# Altium schematic sheet Sensors.SchDoc
size A3; SheetNumber: 5; SheetTotal: 5
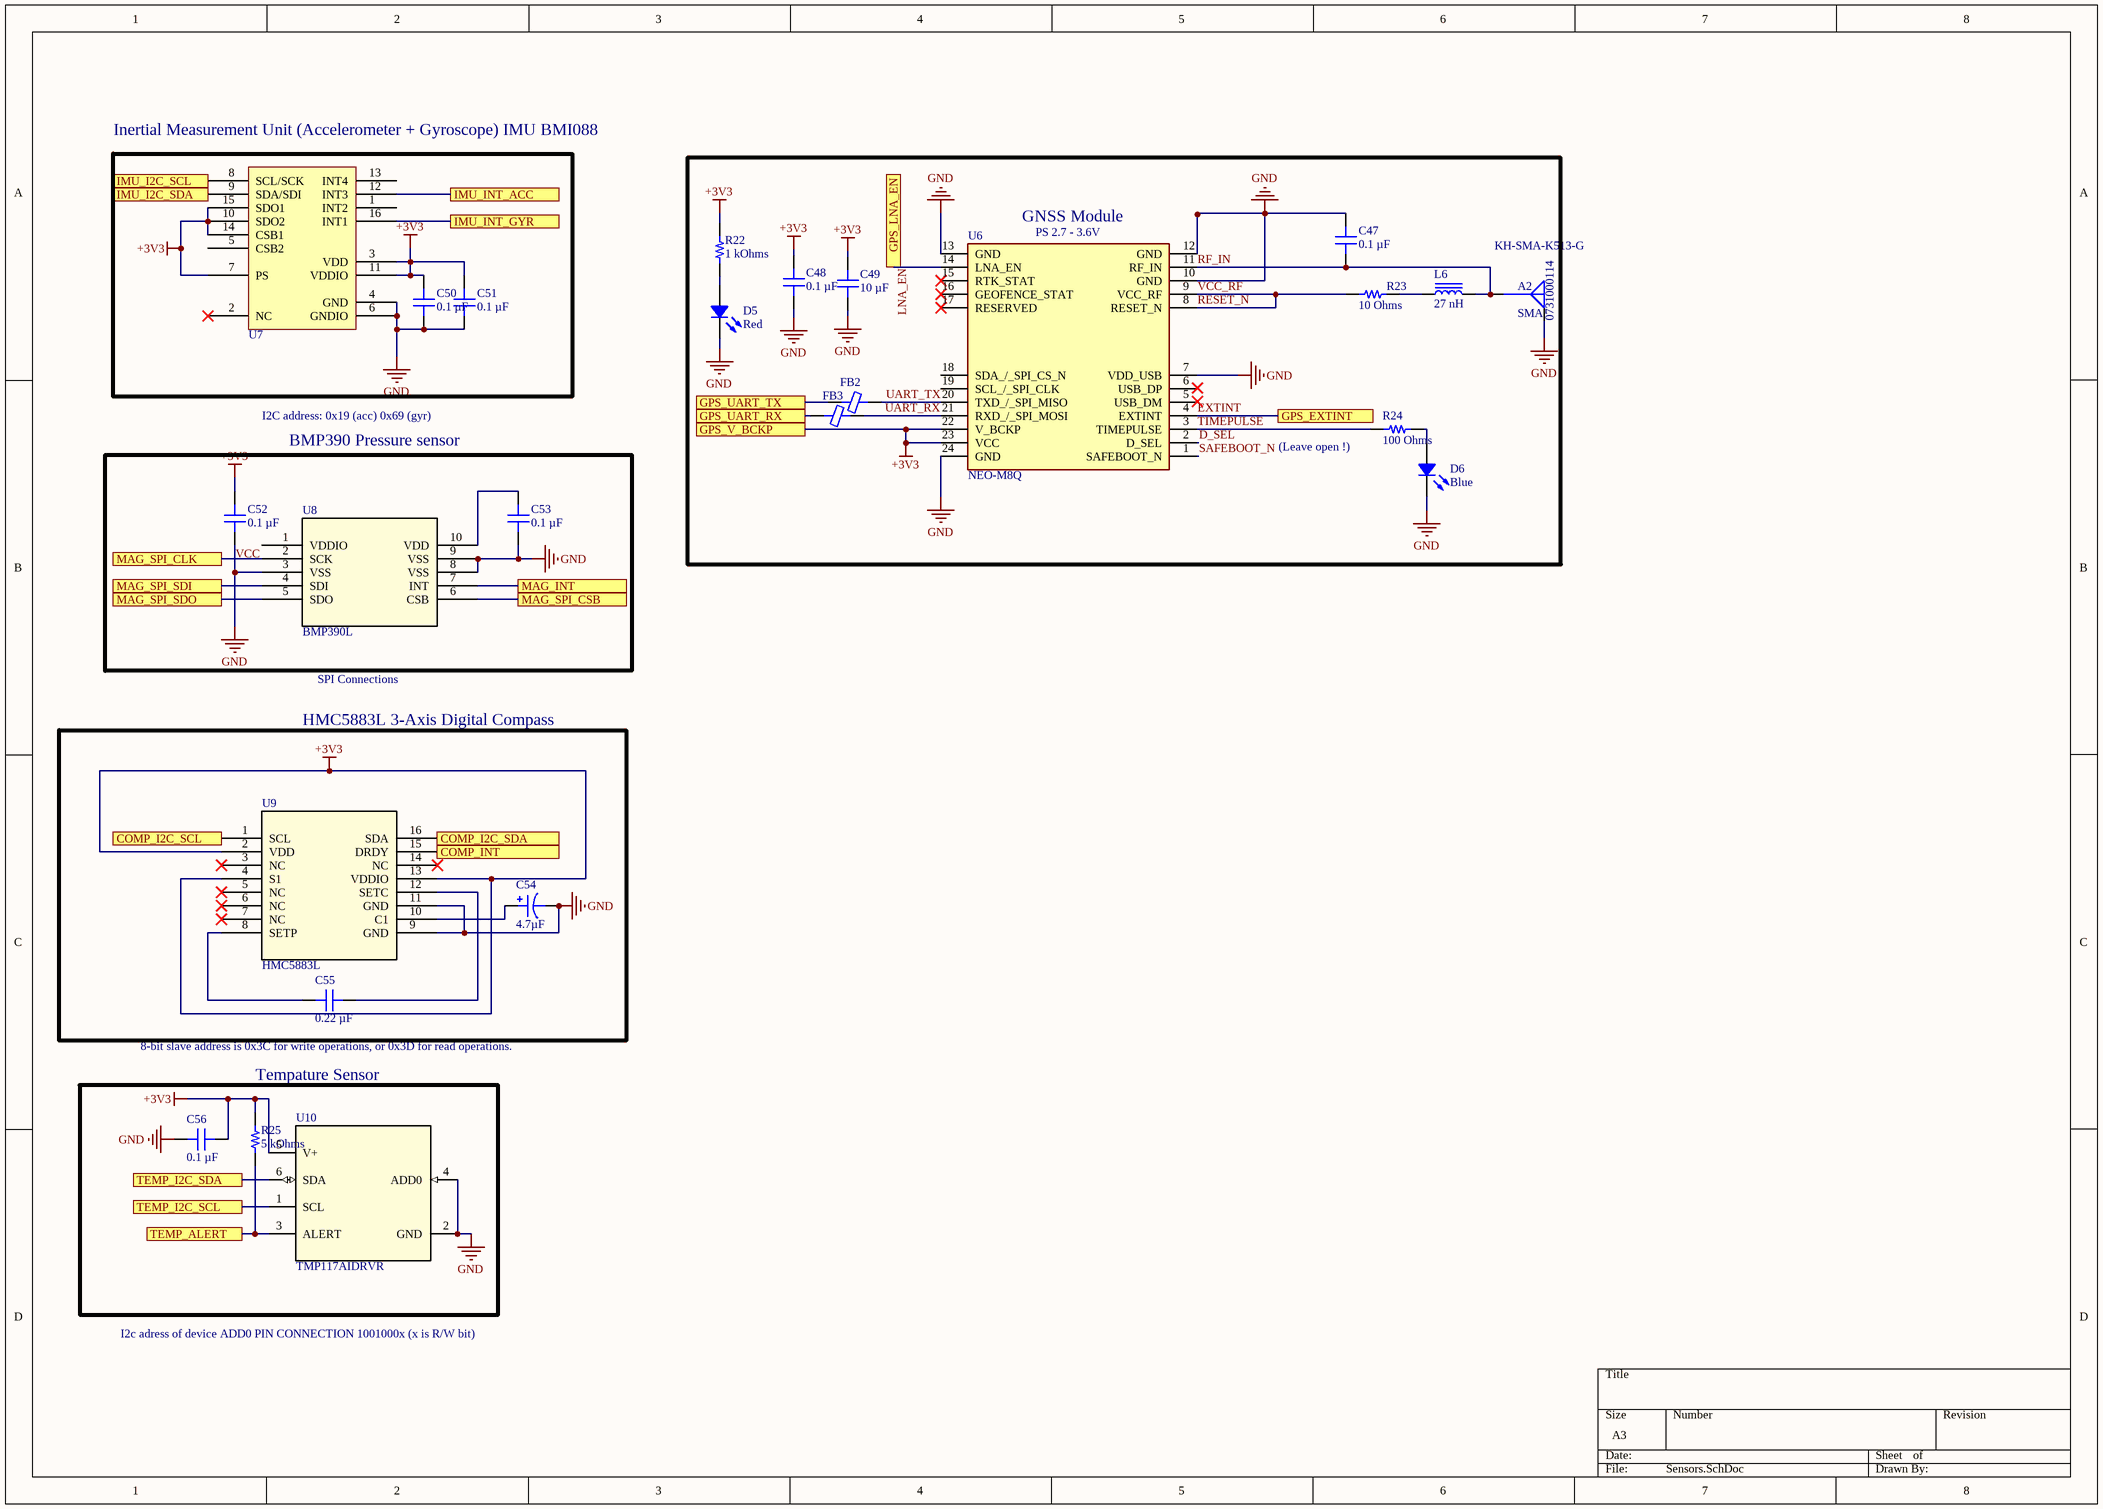
[diagram p0: Sensors.SchDoc]

## Parts
A2  0731000114  Connector Style: SMA  [MOLEX SD-73100-0114]
C47  0.1 µF  [CAP 0402_1005]
C48  0.1 µF  [CAP 0603_1608]
C49  10 µF  [CAP 1210_3225 - 1MM]
C50  value 0.1 µF  [CAP 1206_3216 - 1.8MM]  (hidden comment: 22µF)
C51  0.1 µF  [CAP 0603_1608]
C52  value 0.1 µF  [CAP 0603_1608]  (hidden comment: 220 pF)
C53  value 0.1 µF  [CAP 0603_1608]  (hidden comment: 1 µF)
C54  4.7µF  [CAP POL 1206_3216]
C55  value 0.22 µF  [CAP 0603_1608]  (hidden comment: 10000 pF)
C56  0.1 µF  [CAP 0603_1608]
D5  Red  [LED 0805_2012 RED]
D6  Blue  [LED 0603_1608 BLUE]
FB2  1 kOhms @ 100 MHz  [FER 0402_1005]  (value not drawn)
FB3  1 kOhms @ 100 MHz  [FER 0402_1005]  (value not drawn)
L6  27 nH  [IND 0402_1005]
R22  1 kOhms  [RES 0603_1608]
R23  10 Ohms  [RES 0402_1005]
R24  100 Ohms  [RES 0603_1608]
R25  5 kOhms  [RES 0603_1608]
U6  NEO-M8Q  [NEO-M8U]
U7  BMI088_2  [QFN_BMI085_BOS]  (value not drawn)
U8  BMP390L  [BMP390L_BOS]
U9  HMC5883L  [LPCC16_HNW]
U10  TMP117AIDRVR  [DRV0006B]

## Blocks framed on the sheet
GNSS Module: A2 C47-C49 D5 D6 FB2 FB3 L6 R22-R24 U6
BMP390 Pressure sensor: C52 C53 U8
HMC5883L 3-Axis Digital Compass: C54 C55 U9
Tempature Sensor: C56 R25 U10

## Ports
COMP_I2C_SCL, COMP_I2C_SDA, COMP_INT, GPS_EXTINT, GPS_LNA_EN, GPS_UART_RX, GPS_UART_TX, GPS_V_BCKP, IMU_I2C_SCL, IMU_I2C_SDA, IMU_INT_ACC, IMU_INT_GYR, MAG_INT, MAG_SPI_CLK, MAG_SPI_CSB, MAG_SPI_SDI, MAG_SPI_SDO, TEMP_ALERT, TEMP_I2C_SCL, TEMP_I2C_SDA

## Nets
+3V3: C48.2 C49.2 C50.2 C51.2 C52.2 C56.1 R22.2 R25.2 U6.22(V_BCKP) U6.23(VCC) U7.3(VDD) U7.7(PS) U7.10(SDO2) U7.11(VDDIO) U7.14(CSB1) U7.15(SDO1) U9.2(VDD) U9.4(S1) U9.13(VDDIO) U10.5(V+) ; port GPS_V_BCKP
GND: A2.G C47.2 C48.1 C49.1 C50.1 C51.1 C52.1 C53.1 C54.2 C56.2 D5.2 D6.2 U6.7(VDD_USB) U6.10(GND) U6.12(GND) U6.13(GND) U6.24(GND) U7.4(GND) U7.6(GNDIO) U8.3(VSS) U8.8(VSS) U8.9(VSS) U9.9(GND) U9.11(GND) U10.2(GND) U10.4(ADD0)
COMP_I2C_SCL: U9.1(SCL) ; port COMP_I2C_SCL
COMP_I2C_SDA: U9.16(SDA) ; port COMP_I2C_SDA
COMP_INT: U9.15(DRDY) ; port COMP_INT
D_SEL: U6.2(D_SEL)
EXTINT: U6.4(EXTINT) ; port GPS_EXTINT
GPS_UART_RX: FB3.1 ; port GPS_UART_RX
GPS_UART_TX: FB2.1 ; port GPS_UART_TX
IMU_I2C_SCL: U7.8(SCL/SCK) ; port IMU_I2C_SCL
IMU_I2C_SDA: U7.9(SDA/SDI) ; port IMU_I2C_SDA
IMU_INT_ACC: U7.12(INT3) ; port IMU_INT_ACC
IMU_INT_GYR: U7.16(INT1) ; port IMU_INT_GYR
LNA_EN: U6.14(LNA_EN) ; port GPS_LNA_EN
MAG_INT: U8.7(INT) ; port MAG_INT
MAG_SPI_CLK: U8.2(SCK) ; port MAG_SPI_CLK
MAG_SPI_CSB: U8.6(CSB) ; port MAG_SPI_CSB
MAG_SPI_SDI: U8.4(SDI) ; port MAG_SPI_SDI
MAG_SPI_SDO: U8.5(SDO) ; port MAG_SPI_SDO
RESET_N: R23.1 U6.8(RESET_N) U6.9(VCC_RF)  [also labelled VCC_RF]
RF_IN: A2.S C47.1 L6.2 U6.11(RF_IN)
SAFEBOOT_N: U6.1(SAFEBOOT_N)
TEMP_ALERT: R25.1 U10.3(ALERT) ; port TEMP_ALERT
TEMP_I2C_SCL: U10.1(SCL) ; port TEMP_I2C_SCL
TEMP_I2C_SDA: U10.6(SDA) ; port TEMP_I2C_SDA
TIMEPULSE: R24.2 U6.3(TIMEPULSE)
UART_RX: FB3.2 U6.21(RXD_/_SPI_MOSI)
UART_TX: FB2.2 U6.20(TXD_/_SPI_MISO)
VCC: U8.1(VDDIO)
NetC53_2: C53.2 U8.10(VDD)
NetC54_1: C54.1 U9.10(C1)
NetC55_1: C55.1 U9.8(SETP)
NetC55_2: C55.2 U9.12(SETC)
NetD5_1: D5.1 R22.1
NetD6_1: D6.1 R24.1
NetL6_1: L6.1 R23.2

Not connected (* = marked no-connect by the designer): U6 5(USB_DM) 6(USB_DP) 15(RTK_STAT)* 16(GEOFENCE_STAT)* 17(RESERVED)* 18(SDA_/_SPI_CS_N) 19(SCL_/_SPI_CLK); U7 1(INT2) 2(NC)* 5(CSB2) 13(INT4); U9 3(NC)* 5(NC)* 6(NC)* 7(NC)* 14(NC)*

## Notes on the sheet
- (near U7) Inertial Measurement Unit (Accelerometer + Gyroscope) IMU BMI088
- (near U6) PS 2.7 - 3.6V
- KH-SMA-K513-G
- I2C address: 0x19 (acc) 0x69 (gyr)
- (near R24) (Leave open !)
- SPI Connections
- (near C55) 8-bit slave address is 0x3C for write operations, or 0x3D for read operations.
- I2c adress of device ADD0 PIN CONNECTION 1001000x (x is R/W bit)

## Library data of the parts
A2 = 0731000114: CONN SMA RCPT R/A 50 OHM PCB; Manufacturer: Molex; Connector Type: Receptacle, Female Socket; Contact Termination: Solder; Frequency - Max: 18 GHz; Impedance: 50Ohm; Number of Ports: 1; Part Number: 0731000114; ComponentLink1Description: Datasheet; ComponentLink1URL: https://www.molex.com/pdm_docs/sd/731000114_sd.pdf; ComponentLink2Description: DigiKey Link; ComponentLink2URL: https://www.digikey.com/en/products/detail/molex/0731000114/1465147; Fastening Type: Threaded; Housing Color: Gold; LastUpdated: 29.06.2022 18:00:24; Lifecycle Status: Active; Minimum Order: 1; Mounting Type: Through Hole, Right Angle; Packaging: Tray; Part Status: Active; Price: 3.19; Series: 73100; Shield Termination: Solder; Supplier 1: DigiKey; Supplier Part Number 1: WM5525-ND
C47 = CL05B104KO5NNNC: CAP CER 0.1UF 16V X7R 0402; manufacturer: Samsung Electro-Mechanics; Tolerance: ±10%; Part Number: CL05B104KO5NNNC; Value: 0.1 µF; Applications: General Purpose; Capacitance: 0.1 µF; componentlink1description: Datasheet; componentlink1url: http://www.samsungsem.com/kr/support/product-search/mlcc/CL05B104KO5NNNC.jsp; componentlink2description: DigiKey Link; componentlink2url: https://www.digikey.com/en/products/detail/samsung-electro-mechanics/CL05B104KO5NNNC/3886659; Device Package: 0402 (1005 Metric); lastupdated: 3.03.2023 20:04:29; Lifecycle Status: Active; Minimum Order: 1; Mounting Type: Surface Mount, MLCC; Operating Temperature: -55°C ~ 125°C; Package / Case: 0402 (1005 Metric); packaging: CutTape; partid: 6066; Part Status: Active; price: 0.01; series: CL; Size / Dimension: 0.039" L x 0.020" W (1.00mm x 0.50mm); Supplier 1: DigiKey; Supplier Part Number 1: 1276-1001-1-ND; Temperature Coefficient: X7R; Thickness (Max): 0.022" (0.55mm); Voltage - Rated: 16V
C48 = CC0603KRX7R6BB104: CAP CER 0.1UF 10V X7R 0603; manufacturer: Yageo; Tolerance: ±10%; Part Number: CC0603KRX7R6BB104; Value: 0.1 µF; Applications: General Purpose; Capacitance: 0.1 µF; componentlink1description: Datasheet; componentlink1url: https://www.yageo.com/upload/media/product/productsearch/datasheet/mlcc/UPY-GPHC_X7R_6.3V-to-50V_18.pdf; componentlink2description: DigiKey Link; componentlink2url: https://www.digikey.com/en/products/detail/yageo/CC0603KRX7R6BB104/5883741; Device Package: 0603 (1608 Metric); lastupdated: 7.03.2023 20:08:13; Lifecycle Status: Active; Minimum Order: 1; Mounting Type: Surface Mount, MLCC; Operating Temperature: -55°C ~ 125°C; Package / Case: 0603 (1608 Metric); packaging: TapeAndReel; partid: 7937; Part Status: Active; price: 0.01; series: CC; Size / Dimension: 0.063" L x 0.031" W (1.60mm x 0.80mm); Supplier 1: DigiKey; Supplier Part Number 1: 311-4055-1-ND; Temperature Coefficient: X7R; Thickness (Max): 0.035" (0.90mm); Voltage - Rated: 10V
C49 = EMK325BJ106KN-T: CAP CER 10UF 16V X5R 1210; manufacturer: Taiyo Yuden; Tolerance: ±10%; Part Number: EMK325BJ106KN-T; Value: 10 µF; Applications: SMPS Filtering; Capacitance: 10 µF; componentlink1description: Datasheet; componentlink1url: http://www.yuden.co.jp/productdata/catalog/mlcc06_e.pdf; componentlink2description: DigiKey Link; componentlink2url: https://www.digikey.com/en/products/detail/taiyo-yuden/EMK325BJ106KN-T/930729; Device Package: 1210 (3225 Metric); lastupdated: 7.03.2023 20:30:00; Lifecycle Status: Active; Minimum Order: 1; Mounting Type: Surface Mount, MLCC; Operating Temperature: -55°C ~ 85°C; Package / Case: 1210 (3225 Metric); packaging: TapeAndReel; partid: 47465; Part Status: Active; price: 0.07; series: M; Size / Dimension: 0.126" L x 0.098" W (3.20mm x 2.50mm); Supplier 1: DigiKey; Supplier Part Number 1: 587-1376-1-ND; Temperature Coefficient: X5R; Thickness (Max): 0.083" (2.10mm); Voltage - Rated: 16V
C50-C53 = CL10B104KO8NNNC: CAP CER 0.1UF 16V X7R 0603; manufacturer: Samsung Electro-Mechanics; Tolerance: ±10%; Part Number: CL10B104KO8NNNC; Applications: General Purpose; Capacitance: 0.1 µF; componentlink1description: Datasheet; componentlink1url: http://www.samsungsem.com/kr/support/product-search/mlcc/CL10B104KO8NNNC.jsp; componentlink2description: DigiKey Link; componentlink2url: https://www.digikey.com/en/products/detail/samsung-electro-mechanics/CL10B104KO8NNNC/3886663; Device Package: 0603 (1608 Metric); lastupdated: 28.02.2023 20:08:16; Lifecycle Status: Active; Minimum Order: 1; Mounting Type: Surface Mount, MLCC; Operating Temperature: -55°C ~ 125°C; Package / Case: 0603 (1608 Metric); packaging: TapeAndReel; partid: 9791; Part Status: Active; price: 0.01; series: CL; Size / Dimension: 0.063" L x 0.031" W (1.60mm x 0.80mm); Supplier 1: DigiKey; Supplier Part Number 1: 1276-1005-1-ND; Temperature Coefficient: X7R; Thickness (Max): 0.035" (0.90mm); Voltage - Rated: 16V
  C51: Value: 0.1 µF
C54 = TAJA475K016RNJ: CAP TANT 4.7UF 10% 16V 1206; manufacturer: AVX Corporation; Manufacturer Size Code: A; ESR (Equivalent Series Resistance): 4Ohm; Type: Molded; Part Number: TAJA475K016RNJ; Value: 4.7µF; Capacitance: 4.7µF; componentlink1description: Datasheet; componentlink1url: http://datasheets.avx.com/TAJ.pdf; componentlink2description: DigiKey Link; componentlink2url: http://digikey.com/product-detail/en/avx-corporation/TAJA475K016RNJ/478-3868-1-ND/1126914; Device Package: 1206 (3216 Metric); Features: General Purpose; Height - Seated (Max): 0.071" (1.80mm); lastupdated: 2.09.2020 01:15:58; Lifecycle Status: Active; Minimum Order: 1; Mounting Type: Surface Mount; Operating Temperature: -55°C ~ 125°C; Package / Case: 1206 (3216 Metric); packaging: TapeAndReel; partid: 328; Part Status: Active; price: 0.09; series: TAJ; Size / Dimension: 0.126" L x 0.063" W (3.20mm x 1.60mm); Supplier 1: DigiKey; Supplier Part Number 1: 478-3868-1-ND; Tolerance: ±10%; Voltage - Rated: 16V
C55 = CL05A224KP5NNNC: CAP CER 0.22UF 10V X5R 0402; manufacturer: Samsung Electro-Mechanics; Tolerance: ±10%; Part Number: CL05A224KP5NNNC; Applications: General Purpose; Capacitance: 0.22 µF; componentlink1description: Datasheet; componentlink1url: http://www.samsungsem.com/kr/support/product-search/mlcc/CL05A224KP5NNNC.jsp; componentlink2description: DigiKey Link; componentlink2url: https://www.digikey.com/en/products/detail/samsung-electro-mechanics/CL05A224KP5NNNC/3886707; Device Package: 0402 (1005 Metric); lastupdated: 28.02.2023 20:04:39; Lifecycle Status: Active; Minimum Order: 1; Mounting Type: Surface Mount, MLCC; Operating Temperature: -55°C ~ 85°C; Package / Case: 0402 (1005 Metric); packaging: TapeAndReel; partid: 3132; Part Status: Active; price: 0.01; series: CL; Size / Dimension: 0.039" L x 0.020" W (1.00mm x 0.50mm); Supplier 1: DigiKey; Supplier Part Number 1: 1276-1049-1-ND; Temperature Coefficient: X5R; Thickness (Max): 0.022" (0.55mm); Voltage - Rated: 10V
C56 = CC0603KRX7R7BB104: CAP CER 0.1UF 16V X7R 0603; manufacturer: Yageo; Tolerance: ±10%; Part Number: CC0603KRX7R7BB104; Value: 0.1 µF; Applications: General Purpose; Capacitance: 0.1 µF; componentlink1description: Datasheet; componentlink1url: https://www.yageo.com/upload/media/product/productsearch/datasheet/mlcc/UPY-GPHC_X7R_6.3V-to-50V_18.pdf; componentlink2description: DigiKey Link; componentlink2url: https://www.digikey.com/en/products/detail/yageo/CC0603KRX7R7BB104/302822; Device Package: 0603 (1608 Metric); lastupdated: 4.08.2022 04:29:59; Lifecycle Status: Active; Minimum Order: 1; Mounting Type: Surface Mount, MLCC; Operating Temperature: -55°C ~ 125°C; Package / Case: 0603 (1608 Metric); packaging: TapeAndReel; partid: 16746; Part Status: Active; price: 0.01; series: CC; Size / Dimension: 0.063" L x 0.031" W (1.60mm x 0.80mm); Supplier 1: DigiKey; Supplier Part Number 1: 311-1088-1-ND; Temperature Coefficient: X7R; Thickness (Max): 0.035" (0.90mm); Voltage - Rated: 16V
D5 = LTST-C170KRKT: LED RED CLEAR SMD; Manufacturer: Lite-On Inc.; Configuration: Standard; Current - Test: 20mA; Lens Color: Colorless; Lens Size: 1.40mm x 1.25mm; Lens Style: Rectangle with Flat Top; Millicandela Rating: 54mcd; Viewing Angle: 130°; Voltage - Forward (Vf) (Typ): 2V; Wavelength - Dominant: 631nm; Wavelength - Peak: 639nm; Part Number: LTST-C170KRKT; Color: Red; ComponentLink1Description: Datasheet; ComponentLink1URL: http://optoelectronics.liteon.com/upload/download/DS-22-99-0150/LTST-C170KRKT.pdf; ComponentLink2Description: DigiKey Link; ComponentLink2URL: http://digikey.com/product-detail/en/lite-on-inc/LTST-C170KRKT/160-1415-1-ND/386778; Device Package: 0805 (2012 Metric); Height (Max): 1.10mm; LastUpdated: 7.03.2023 20:55:45; Lens Transparency: Clear; Lifecycle Status: Active; Minimum Order: 1; Mounting Type: Surface Mount; Package / Case: 0805 (2012 Metric); Packaging: TapeAndReel; PartId: 350; Part Status: Active; Price: 0.06; Series: -; Size / Dimension: 2.00mm L x 1.25mm W; Supplier 1: DigiKey; Supplier Part Number 1: 160-1415-1-ND; Value: Red
D6 = LTST-C190TBKT: LED BLUE CLEAR CHIP SMD; Manufacturer: Lite-On Inc.; Configuration: Standard; Current - Test: 20mA; Lens Color: Colorless; Lens Size: 1.10mm x 0.80mm; Lens Style: Rectangle with Flat Top; Millicandela Rating: 104mcd; Viewing Angle: 130°; Voltage - Forward (Vf) (Typ): 3.3V; Wavelength - Dominant: 470nm; Wavelength - Peak: 468nm; Part Number: LTST-C190TBKT; Color: Blue; ComponentLink1Description: Datasheet; ComponentLink1URL: http://optoelectronics.liteon.com/upload/download/DS-22-99-0224/LTST-C190TBKT.PDF; ComponentLink2Description: DigiKey Link; ComponentLink2URL: http://digikey.com/product-detail/en/lite-on-inc/LTST-C190TBKT/160-1646-1-ND/573586; Device Package: 0603 (1608 Metric); Height (Max): 0.90mm; LastUpdated: 5.03.2023 20:55:19; Lens Transparency: Clear; Lifecycle Status: Active; Minimum Order: 1; Mounting Type: Surface Mount; Package / Case: 0603 (1608 Metric); Packaging: TapeAndReel; PartId: 831; Part Status: Active; Price: 0.08; Series: -; Size / Dimension: 1.60mm L x 0.80mm W; Supplier 1: DigiKey; Supplier Part Number 1: 160-1646-1-ND; Supplier Device Package: Chip LED; Value: Blue
FB2 FB3 = BLM15AX102SN1D: FERRITE BEAD 1K OHM 0402 1LN; Manufacturer: Murata Electronics; Current Rating (Max): 350mA; DC Resistance (DCR) (Max): 490mOhm; Number of Lines: 1; Part Number: BLM15AX102SN1D; ComponentLink1Description: Datasheet; ComponentLink1URL: https://www.murata.com/en-us/products/productdata/8796740059166/ENFA0018.pdf; ComponentLink2Description: DigiKey Link; ComponentLink2URL: https://www.digikey.com/en/products/detail/murata-electronics/BLM15AX102SN1D/2256877; Device Package: 0402 (1005 Metric); Height (Max): 0.022" (0.55mm); Impedance @ Frequency: 1 kOhms @ 100 MHz; LastUpdated: 7.03.2023 20:49:02; Lifecycle Status: Active; Minimum Order: 1; Mounting Type: Surface Mount; Operating Temperature: -55°C ~ 125°C; Package / Case: 0402 (1005 Metric); Packaging: TapeAndReel; PartId: 398; Part Status: Active; Price: 0.01; Series: EMIFIL®, BLM15; Size / Dimension: 0.039" L x 0.022" W (1.00mm x 0.55mm); Supplier 1: DigiKey; Supplier Part Number 1: 490-5442-1-ND; Value: 1 kOhms @ 100 MHz
L6 = LQG15HS27NJ02D: FIXED IND 27NH 350MA 460MOHM SMD; Manufacturer: Murata Electronics; DC Resistance (DCR): 460mOhm Max; Frequency - Self Resonant: 1.7GHz; Inductance Frequency - Test: 100 MHz; Material - Core: Air; Q @ Freq: 8 @ 100MHz; Shielding: Unshielded; Tolerance: ±5%; Type: Multilayer; Part Number: LQG15HS27NJ02D; ComponentLink1Description: Datasheet; ComponentLink1URL: https://search.murata.co.jp/Ceramy/image/img/P02/JELF243B-0010.pdf; ComponentLink2Description: DigiKey Link; ComponentLink2URL: https://www.digikey.com/en/products/detail/murata-electronics/LQG15HS27NJ02D/662877; Current Rating (Amps): 350 mA; Device Package: 0402 (1005 Metric); Height - Seated (Max): 0.022" (0.55mm); Inductance: 27 nH; LastUpdated: 7.03.2023 21:02:57; Lifecycle Status: Active; Minimum Order: 1; Mounting Type: Surface Mount; Operating Temperature: -55°C ~ 125°C; Package / Case: 0402 (1005 Metric); Packaging: TapeAndReel; PartId: 1475; Part Status: Active; Price: 0.02; Series: LQG15; Size / Dimension: 0.039" L x 0.020" W (1.00mm x 0.50mm); Supplier 1: DigiKey; Supplier Part Number 1: 490-2628-1-ND; Supplier Device Package: 0402 (1005 Metric); Value: 27 nH
R22 = RC0603FR-071KL: RES SMD 1K OHM 1% 1/10W 0603; Manufacturer: Yageo; Power (Watts): 0.1W, 1/10W; Temperature Coefficient: ±100ppm/°C; Part Number: RC0603FR-071KL; Value: 1 kOhms; ComponentLink1Description: Datasheet; ComponentLink1URL: https://www.yageo.com/upload/media/product/productsearch/datasheet/rchip/PYu-RC_Group_51_RoHS_L_10.pdf; ComponentLink2Description: DigiKey Link; ComponentLink2URL: http://digikey.com/product-detail/en/yageo/RC0603FR-071KL/311-1.00KHRCT-ND/729790; Composition: Thick Film; Device Package: 0603 (1608 Metric); Features: Moisture Resistant; Height - Seated (Max): 0.022" (0.55mm); LastUpdated: 2.09.2020 01:09:45; Lifecycle Status: Active; Minimum Order: 1; Number of Terminations: 2; Operating Temperature: -55°C ~ 155°C; Package / Case: 0603 (1608 Metric); Packaging: CutTape; PartId: 22600; Part Status: Active; Price: 0.10; Resistance: 1 kOhms; Series: RC; Size / Dimension: 0.063" L x 0.031" W (1.60mm x 0.80mm); Supplier 1: DigiKey; Supplier Part Number 1: 311-1.00KHRCT-ND; Supplier Device Package: 0603; Tolerance: ±1%
R23 = ERA-2AKD100X: RES SMD 10 OHM 0.5% 1/16W 0402; Manufacturer: Panasonic Electronic Components; Power (Watts): 0.063W, 1/16W; Temperature Coefficient: ±100ppm/°C; Part Number: ERA-2AKD100X; Value: 10 Ohms; ComponentLink1Description: Datasheet; ComponentLink1URL: https://industrial.panasonic.com/cdbs/www-data/pdf/RDM0000/AOA0000C307.pdf; ComponentLink2Description: DigiKey Link; ComponentLink2URL: http://digikey.com/product-detail/en/panasonic-electronic-components/ERA-2AKD100X/P10DDCT-ND/1706232; Composition: Thin Film; Device Package: 0402 (1005 Metric); Features: Automotive AEC-Q200; Height - Seated (Max): 0.016" (0.40mm); LastUpdated: 2.09.2020 01:08:09; Lifecycle Status: Active; Minimum Order: 1; Number of Terminations: 2; Operating Temperature: -55°C ~ 155°C; Package / Case: 0402 (1005 Metric); Packaging: TapeAndReel; PartId: 3168; Part Status: Active; Price: 0.01; Ratings: AEC-Q200; Resistance: 10 Ohms; Series: ERA-2A; Size / Dimension: 0.039" L x 0.020" W (1.00mm x 0.50mm); Supplier 1: DigiKey; Supplier Part Number 1: P10DDCT-ND; Supplier Device Package: 0402; Tolerance: ±0.5%
R24 = RK73G1JTTD1000F: RES 100 OHM 1% 1/10W 0603; Manufacturer: KOA Speer Electronics, Inc.; Power (Watts): 0.1W, 1/10W; Temperature Coefficient: ±50ppm/°C; Part Number: RK73G1JTTD1000F; Value: 100 Ohms; ComponentLink1Description: Datasheet; ComponentLink1URL: https://www.koaspeer.com/pdfs/RK73G.pdf; ComponentLink2Description: DigiKey Link; ComponentLink2URL: https://www.digikey.com/en/products/detail/koa-speer-electronics-inc/RK73G1JTTD1000F/9854468; Composition: Thick Film; Device Package: 0603 (1608 Metric); Features: Automotive AEC-Q200; Height - Seated (Max): 0.022" (0.55mm); LastUpdated: 5.03.2023 20:27:16; Lifecycle Status: Active; Minimum Order: 1; Number of Terminations: 2; Operating Temperature: -55°C ~ 155°C; Package / Case: 0603 (1608 Metric); Packaging: TapeAndReel; PartId: 65534; Part Status: Active; Price: 0.03; Ratings: AEC-Q200; Resistance: 100 Ohms; Series: RK73G; Size / Dimension: 0.063" L x 0.031" W (1.60mm x 0.80mm); Supplier 1: DigiKey; Supplier Part Number 1: 2019-RK73G1JTTD1000FCT-ND; Supplier Device Package: 0603; Tolerance: ±1%
R25 = RT0603BRE075KL: RES 5K OHM 0.1% 1/10W 0603; Manufacturer: Yageo; Power (Watts): 0.1W, 1/10W; Temperature Coefficient: ±50ppm/°C; Part Number: RT0603BRE075KL; Value: 5 kOhms; ComponentLink1Description: Datasheet; ComponentLink1URL: https://www.yageo.com/upload/media/product/productsearch/datasheet/rchip/PYu-RT_1-to-0.01_RoHS_L_12.pdf; ComponentLink2Description: DigiKey Link; ComponentLink2URL: https://www.digikey.com/en/products/detail/yageo/RT0603BRE075KL/7708365; Composition: Thin Film; Device Package: 0603 (1608 Metric); Height - Seated (Max): 0.022" (0.55mm); LastUpdated: 21.08.2022 20:20:42; Lifecycle Status: Active; Minimum Order: 1; Number of Terminations: 2; Operating Temperature: -55°C ~ 155°C; Package / Case: 0603 (1608 Metric); Packaging: TapeAndReel; PartId: 67915; Part Status: Active; Price: 0.05; Resistance: 5 kOhms; Series: RT; Size / Dimension: 0.063" L x 0.031" W (1.60mm x 0.80mm); Supplier 1: DigiKey; Supplier Part Number 1: 13-RT0603BRE075KLCT-ND; Supplier Device Package: 0603; Tolerance: ±0.1%
U6 = NEO-M8P-2: Integrated Circuit; Manufacturer_Name: U-Blox; Datasheet Link: https://datasheet.datasheetarchive.com/originals/distributors/DKDS-37/730172.pdf; Manufacturer_Part_Number: NEO-M8P-2; Mouser Part Number: 377-NEO-M8P-2; Mouser Price/Stock: https://www.mouser.co.uk/ProductDetail/u-blox/NEO-M8P-2?qs=zW32dvEIR3um1owIgR0I3w%3D%3D
U8 = BMP390L: No Description Available; Mfr_Name: Bosch Sensortec; Copyright: Copyright (C) 2022 Ultra Librarian. All rights reserved.; Manufacturer_Part_Number: BMP390L; RefDes: RefDes; Type: DEV
U9 = HMC5883L: No Description Available; Mfr_Name: Honeywell; Copyright: Copyright (C) 2022 Ultra Librarian. All rights reserved.; Manufacturer_Part_Number: HMC5883L; RefDes: RefDes; Type: DEV
U10 = TMP117AIDRVR: No Description Available; Mfr_Name: Texas Instruments; Type: DEV; RefDes: RefDes; Copyright: Copyright (C) 2022 Ultra Librarian. All rights reserved.; Manufacturer_Part_Number: TMP117AIDRVR